# Altium project khoaBTVN.PrjPcb
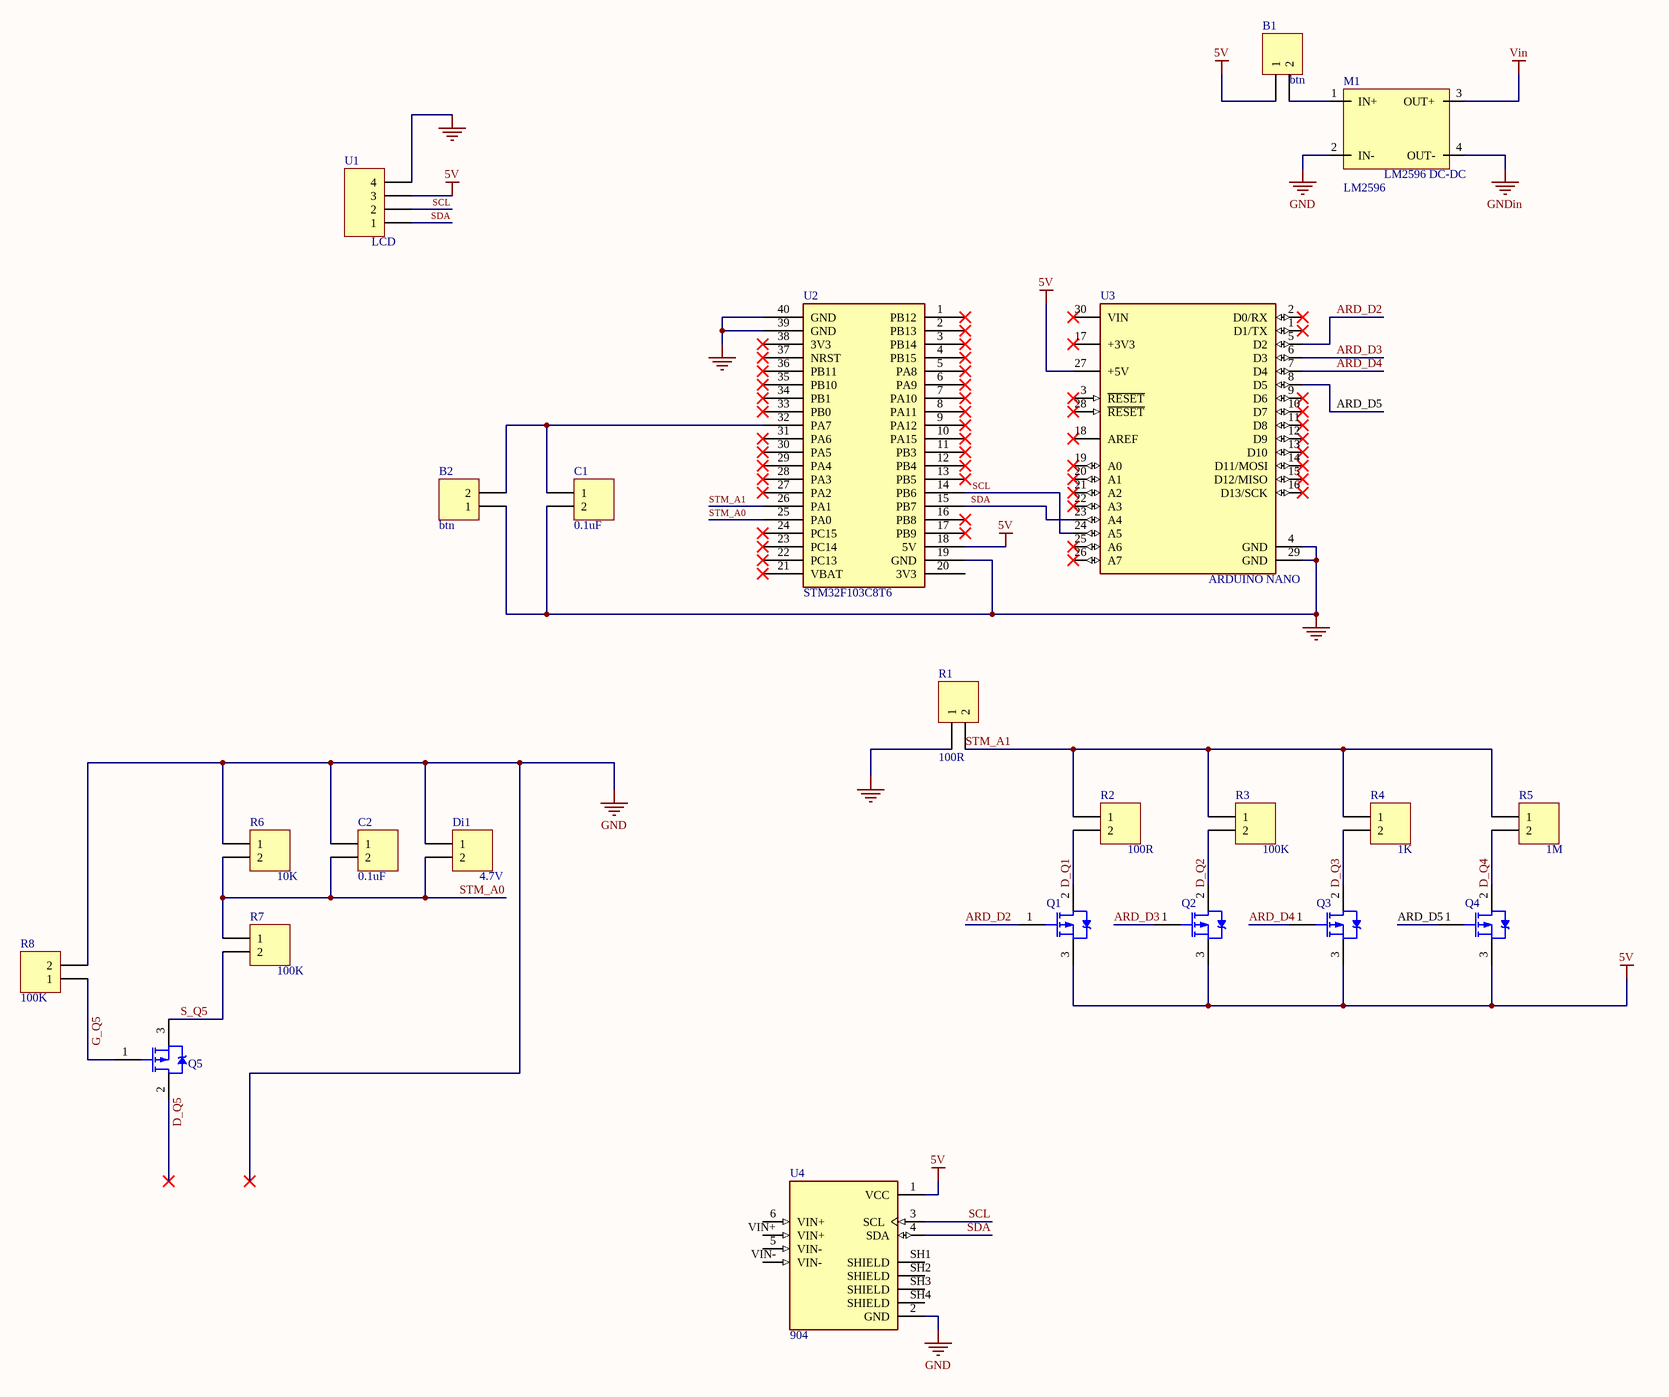
[diagram p0: sche_v1.SchDoc]
1 sheet, 23 parts. Net scope: global (net labels, ports and power ports of the same name join across sheets).
Board file: PCB1.PcbDoc

## Sheet sche_v1.SchDoc
size A2; SheetNumber: 1; SheetTotal: 1

### Parts
B1  btn  [JP2]
B2  btn  [JP2]
C1  0.1uF  [JP2]
C2  0.1uF  [JP2]
Di1  4.7V  [JP2]
M1  LM2596  [LM2596]
Q1  IRF9540N  [IRF9540N-TO-220AB]  (value not drawn)
Q2  IRF9540N  [IRF9540N-TO-220AB]  (value not drawn)
Q3  IRF9540N  [IRF9540N-TO-220AB]  (value not drawn)
Q4  IRF9540N  [IRF9540N-TO-220AB]  (value not drawn)
Q5  IRF9540N  [IRF9540N-TO-220AB]  (value not drawn)
R1  100R  [JP2]
R2  100R  [JP2]
R3  100K  [JP2]
R4  1K  [JP2]
R5  1M  [JP2]
R6  10K  [JP2]
R7  100K  [JP2]
R8  100K  [JP2]
U1  LCD  [JP4]
U2  STM32F103C8T6  [Stm32 BluePill]
U3  ARDUINO NANO  [FP-A000005-MFG]
U4  904  [MODULE_904]

### Nets
5V: B1.1 Q1.3(S) Q2.3(S) Q3.3(S) Q4.3(S) U1.3 U2.18(5V) U3.27(+5V) U4.1(VCC)
GND: B2.1 C1.2 C2.1 Di1.1 M1.2(IN-) R1.1 R6.1 R8.2 U1.4 U2.19(GND) U2.39(GND) U2.40(GND) U3.4(GND) U3.29(GND) U4.2(GND)
GNDin: M1.4(OUT-)
Vin: M1.3(OUT+)
ARD_D2: Q1.1(G) U3.5(D2)
ARD_D3: Q2.1(G) U3.6(D3)
ARD_D4: Q3.1(G) U3.7(D4)
ARD_D5: Q4.1(G) U3.8(D5)
D_Q1: Q1.2(D) R2.2
D_Q2: Q2.2(D) R3.2
D_Q3: Q3.2(D) R4.2
D_Q4: Q4.2(D) R5.2
D_Q5: Q5.2(D)
G_Q5: Q5.1(G) R8.1
S_Q5: Q5.3(S) R7.2
SCL: U1.2 U2.14(PB6) U3.24(A5) U4.3(SCL)
SDA: U1.1 U2.15(PB7) U3.23(A4) U4.4(SDA)
STM_A0: C2.2 Di1.2 R6.2 R7.1 U2.25(PA0)
STM_A1: R1.2 R2.1 R3.1 R4.1 R5.1 U2.26(PA1)
NetB1_2: B1.2 M1.1(IN+)
NetB2_2: B2.2 C1.1 U2.32(PA7)

Not connected (* = marked no-connect by the designer): U2 1(PB12)* 2(PB13)* 3(PB14)* 4(PB15)* 5(PA8)* 6(PA9)* 7(PA10)* 8(PA11)* 9(PA12)* 10(PA15)* 11(PB3)* 12(PB4)* 13(PB5)* 16(PB8)* 17(PB9)* 20(3V3) 21(VBAT)* 22(PC13)* 23(PC14)* 24(PC15)* 27(PA2)* 28(PA3)* 29(PA4)* 30(PA5)* 31(PA6)* 33(PB0)* 34(PB1)* 35(PB10)* 36(PB11)* 37(NRST)* 38(3V3)*; U3 1(D1/TX)* 2(D0/RX)* 3(~{RESET})* 9(D6)* 10(D7)* 11(D8)* 12(D9)* 13(D10)* 14(D11/MOSI)* 15(D12/MISO)* 16(D13/SCK)* 17(+3V3)* 18(AREF)* 19(A0)* 20(A1)* 21(A2)* 22(A3)* 25(A6)* 26(A7)* 28(~{RESET})* 30(VIN)*; U4 5(VIN-) 6(VIN+) SH1(SHIELD) SH2(SHIELD) SH3(SHIELD) SH4(SHIELD) VIN+ VIN-

### Notes on the sheet
- (in symbol LM2596) LM2596 DC-DC

### Library data of the parts
B1 B2 C1 C2 Di1 R1-R8 = Header 2: Header, 2-Pin; LatestRevisionDate: 17-Jul-2002; LatestRevisionNote: Re-released for DXP Platform.; Publisher: Altium Limited
M1 = LM2596: Module
Q1-Q5 = IRF9540N: MOSFET P-CH, 100V, 23A, 117mOhm, TO220AB; Drain to Source Voltage (Vdss): -100V; Gate-to-Source Voltage (VGS): ±20V; Drain-to-Source On-Resistance: 0.117Ω; Continuous Drain Current: -23A; Total Gate Charge: 97nC; Power Dissipation: 140W; FET Type: P-Channel; Gate Threshold Voltage (Vth): N/A; Device Package: TO-220AB; ComponentLink1Description: Datasheet link; ComponentLink1URL: https://www.mouser.vn/datasheet/2/196/Infineon_IRF9540N_DataSheet_v01_01_EN-3166147.pdf; ComponentLink2Description: Supplier 1 URL; ComponentLink2URL: https://www.mouser.vn/ProductDetail/Infineon-Technologies/IRF9540NPBF?qs=9%252BKlkBgLFf0vnuA8mxUPtw%3D%3D; ComponentLink3Description: Supplier 2 URL; ComponentLink3URL: https://www.digikey.com/en/products/detail/infineon-technologies/IRF9540NPBF/812088; ComponentLink4Description: Supplier 3 URL; ComponentLink4URL: https://www.thegioiic.com/irf9540npbf-mosfet-kenh-p-100v-19a-to-220ab; Supplier 1 Name: Mouser; Supplier 1 SN: 942-IRF9540NPBF; Supplier 1 URL: https://www.mouser.vn/ProductDetail/Infineon-Technologies/IRF9540NPBF?qs=9%252BKlkBgLFf0vnuA8mxUPtw%3D%3D; Supplier 2 Name: Digi-Key; Supplier 2 SN: IRF9540NPBF-ND; Supplier 2 URL: https://www.digikey.com/en/products/detail/infineon-technologies/IRF9540NPBF/812088; Supplier 3 Name: thegioiic; Supplier 3 SN: N/A; Supplier 3 URL: https://www.thegioiic.com/irf9540npbf-mosfet-kenh-p-100v-19a-to-220ab; Value: IRF9540N
U1 = Header 4: Header, 4-Pin; LatestRevisionDate: 17-Jul-2002; LatestRevisionNote: Re-released for DXP Platform.; Publisher: Altium Limited
U2 = BluePill: Designed By @Alixahedi
U3 = CMP-189986-000002-1: ARDUINO NANO ATMEGA328 EVAL BRD; Number of Bits: 8; Evaluation Kit: Yes; Operating Supply Voltage: 12V; Interface: I2C; Data Bus Width: 8b; Core Architecture: AVR; Packaging: Bulk; Length: 7inch; Package Quantity: 50; Width: 5inch; REACH SVHC: No SVHC; Weight: 0.358383oz; Series: AVR® ATmega; Height: 0.25inch
U4 = 904: MF: Adafruit Industries; Package: None; Price: None; Value: *; MP: 904; Availability: Unavailable